# EAGLE design n64cart-v3-soic-16 (EAGLE 9.6.2)
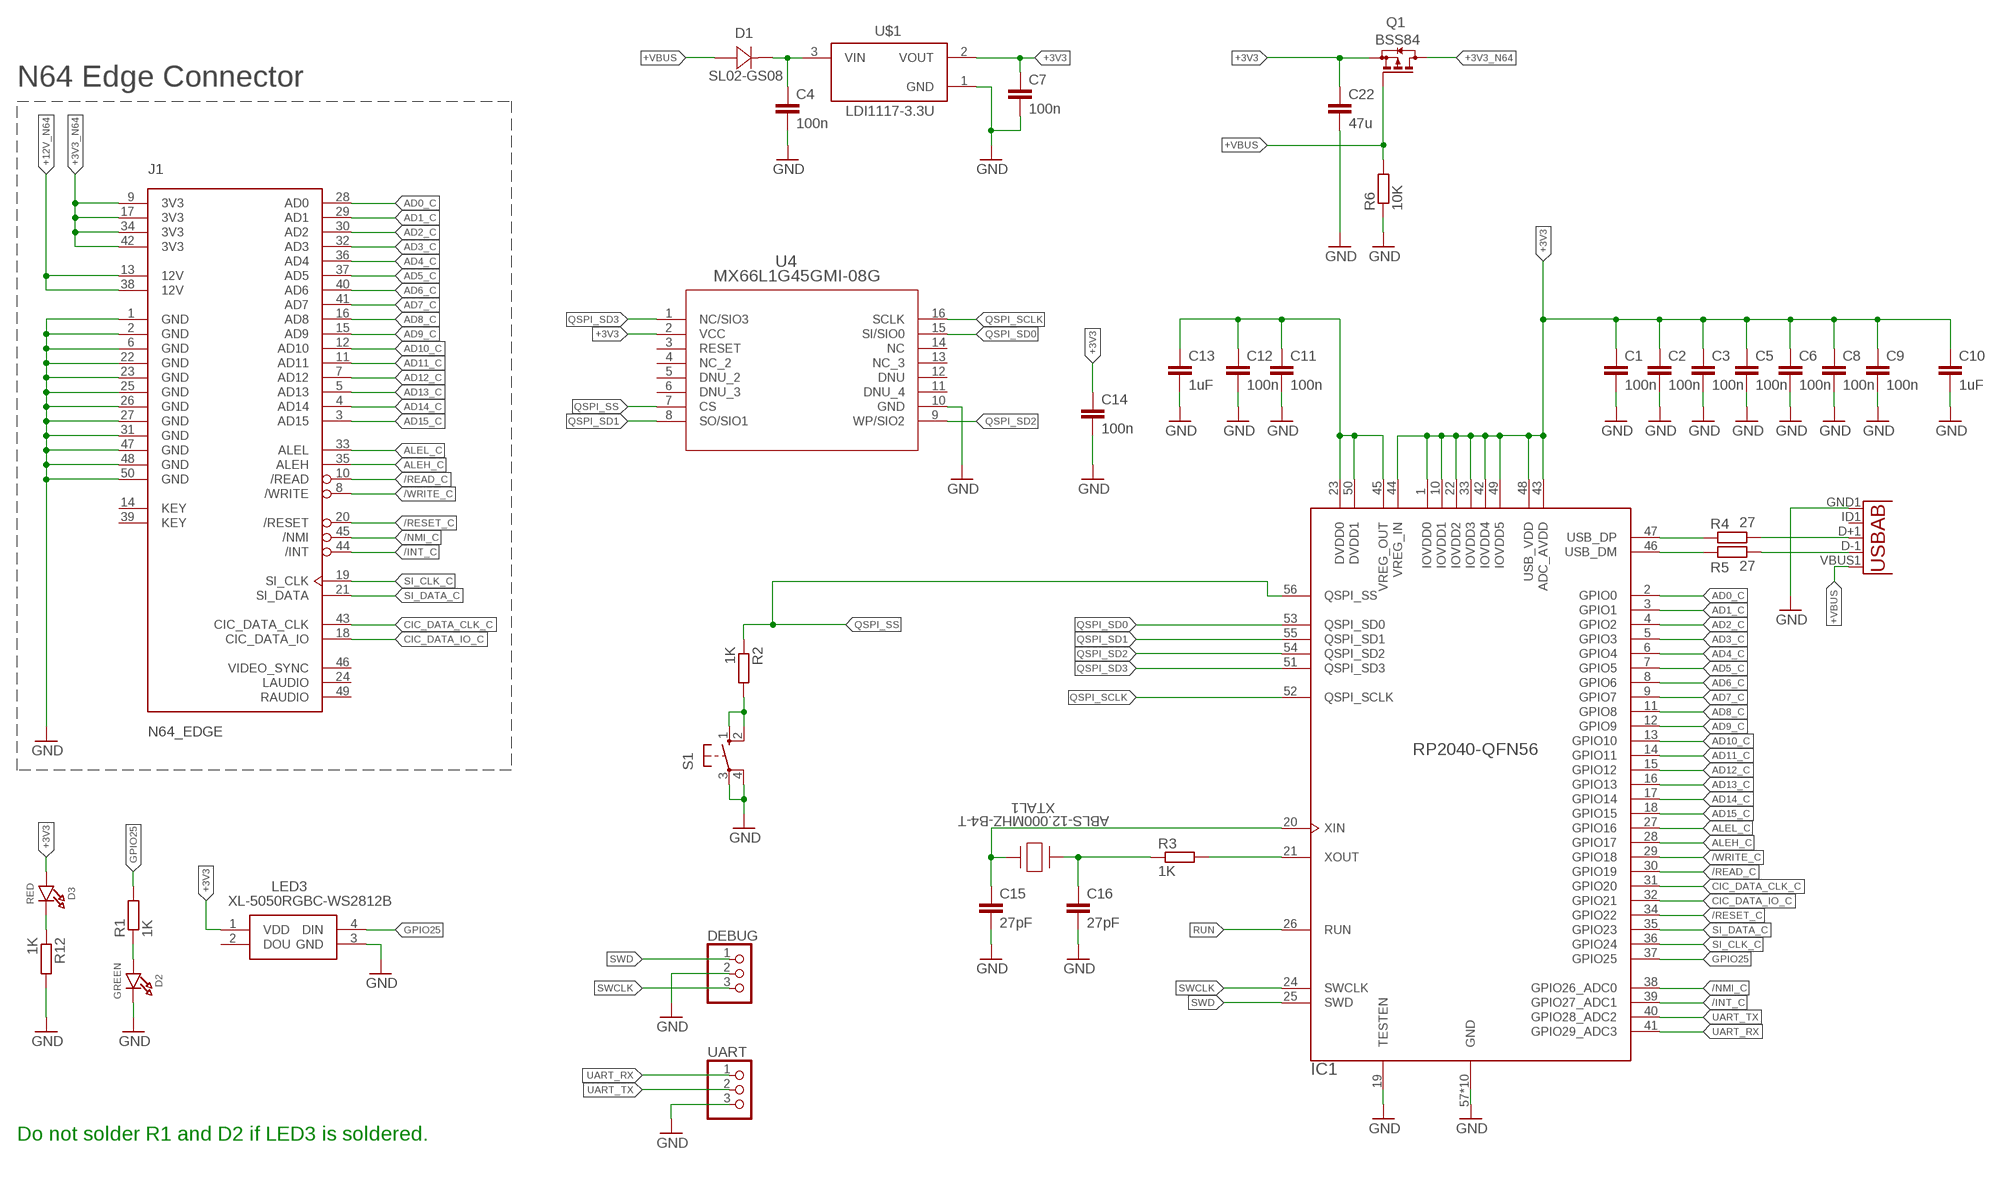
[diagram p0: schematic, sheet 1]

## Parts
C1  100n  C-EUC0402  [C0402]
C2  100n  C-EUC0402  [C0402]
C3  100n  C-EUC0402  [C0402]
C4  100n  C-EUC0603  [C0603]
C5  100n  C-EUC0402  [C0402]
C6  100n  C-EUC0402  [C0402]
C7  100n  C-EUC0603  [C0603]
C8  100n  C-EUC0402  [C0402]
C9  100n  C-EUC0402  [C0402]
C10  1uF  C-EUC0402  [C0402]
C11  100n  C-EUC0402  [C0402]
C12  100n  C-EUC0402  [C0402]
C13  1uF  C-EUC0402  [C0402]
C14  100n  C-EUC0402  [C0402]
C15  27pF  C-EUC0402  [C0402]
C16  27pF  C-EUC0402  [C0402]
C22  47u  C-EUC0805  [C0805]
D1  SL02-GS08  SL02-GS08DIODE_SL02-GS08_VIS-M  [DIODE_SL02-GS08_VIS-M]
D2  GREEN  LED0603_NOOUTLINE  [CHIPLED_0603_NOOUTLINE]
D3  RED  LED0603_NOOUTLINE  [CHIPLED_0603_NOOUTLINE]
DEBUG  PINHD-1X3  [1X03]
IC1  RP2040-QFN56  [RP2040-QFN-56]
J1  N64_EDGE  [N64_EDGE]
LED3  XL-5050RGBC-WS2812B  [XL5050RGBCWS2812B]
Q1  BSS84  [SOT23]
R1  1K  R-EU_R0603  [R0603]
R2  1K  R-EU_R0402  [R0402]
R3  1K  R-EU_R0402  [R0402]
R4  27  R-EU_R0402  [R0402]
R5  27  R-EU_R0402  [R0402]
R6  10K  R-EU_R0603  [R0603]
R12  1K  R-EU_R0603  [R0603]
S1  10-XX  [B3F-10XX]
U2  USB""  [USB-MICRO-SMD]
U4  MX66L1G45GMI-08G  MX66L1G45GMI-08GSOP_16L_300_MAC-L  [SOP_16L_300_MAC-L]
U$1  LDI1117-3.3U  [LDI1117-3.3U]
UART  PINHD-1X3  [1X03]
XTAL1  ABLS-12.000MHZ-B4-T  [XTAL_ABLS_ABR]

## Nets
+3V3: C1.1 C2.1 C3.1 C5.1 C6.1 C7.1 C8.1 C9.1 C10.1 C14.1 C22.1 D3.A IC1.1(IOVDD0) IC1.10(IOVDD1) IC1.22(IOVDD2) IC1.33(IOVDD3) IC1.42(IOVDD4) IC1.43(ADC_AVDD) IC1.44(VREG_IN) IC1.48(USB_VDD) IC1.49(IOVDD5) LED3.1(VDD) Q1.2(S) U4.2(VCC) U$1.2(VOUT)
+3V3_N64: J1.9(3V3) J1.17(3V3) J1.34(3V3) J1.42(3V3) Q1.3(D)
+12V_N64: J1.13(12V) J1.38(12V)
+VBUS: D1.2 Q1.1(G) R6.2 U2.VBUS1(VBUS)
/INT_C: IC1.39(GPIO27_ADC1) J1.44(/INT)
/NMI_C: IC1.38(GPIO26_ADC0) J1.45(/NMI)
/READ_C: IC1.30(GPIO19) J1.10(/READ)
/RESET_C: IC1.34(GPIO22) J1.20(/RESET)
/WRITE_C: IC1.29(GPIO18) J1.8(/WRITE)
AD0_C: IC1.2(GPIO0) J1.28(AD0)
AD1_C: IC1.3(GPIO1) J1.29(AD1)
AD2_C: IC1.4(GPIO2) J1.30(AD2)
AD3_C: IC1.5(GPIO3) J1.32(AD3)
AD4_C: IC1.6(GPIO4) J1.36(AD4)
AD5_C: IC1.7(GPIO5) J1.37(AD5)
AD6_C: IC1.8(GPIO6) J1.40(AD6)
AD7_C: IC1.9(GPIO7) J1.41(AD7)
AD8_C: IC1.11(GPIO8) J1.16(AD8)
AD9_C: IC1.12(GPIO9) J1.15(AD9)
AD10_C: IC1.13(GPIO10) J1.12(AD10)
AD11_C: IC1.14(GPIO11) J1.11(AD11)
AD12_C: IC1.15(GPIO12) J1.7(AD12)
AD13_C: IC1.16(GPIO13) J1.5(AD13)
AD14_C: IC1.17(GPIO14) J1.4(AD14)
AD15_C: IC1.18(GPIO15) J1.3(AD15)
ALEH_C: IC1.28(GPIO17) J1.35(ALEH)
ALEL_C: IC1.27(GPIO16) J1.33(ALEL)
CIC_DATA_CLK_C: IC1.31(GPIO20) J1.43(CIC_DATA_CLK)
CIC_DATA_IO_C: IC1.32(GPIO21) J1.18(CIC_DATA_IO)
GND: C1.2 C2.2 C3.2 C4.2 C5.2 C6.2 C7.2 C8.2 C9.2 C10.2 C11.2 C12.2 C13.2 C14.2 C15.2 C16.2 C22.2 D2.C DEBUG.2 IC1.19(TESTEN) IC1.57(GND) IC1.58(GND) IC1.59(GND) IC1.60(GND) IC1.61(GND) IC1.62(GND) IC1.63(GND) IC1.64(GND) IC1.65(GND) IC1.66(GND) J1.1(GND) J1.2(GND) J1.6(GND) J1.22(GND) J1.23(GND) J1.25(GND) J1.26(GND) J1.27(GND) J1.31(GND) J1.47(GND) J1.48(GND) J1.50(GND) LED3.3(GND) R6.1 R12.2 S1.3(P) S1.4(P1) U2.GND1(GND) U4.10(GND) U$1.1(GND) UART.3
GPIO25: IC1.37(GPIO25) LED3.4(DIN) R1.2
N$1: C4.1 D1.1 U$1.3(VIN)
N$2: R5.2 U2.D-1(D-)
N$3: R4.2 U2.D+1(D+)
N$4: D3.C R12.1
N$5: C11.1 C12.1 C13.1 IC1.23(DVDD0) IC1.45(VREG_OUT) IC1.50(DVDD1)
N$8: D2.A R1.1
N$16: R2.2 S1.1(S) S1.2(S1)
N$17: C16.1 R3.1 XTAL1.1
N$18: C15.1 IC1.20(XIN) XTAL1.2
N$19: IC1.21(XOUT) R3.2
N$20: IC1.47(USB_DP) R4.1
N$21: IC1.46(USB_DM) R5.1
QSPI_SCLK: IC1.52(QSPI_SCLK) U4.16(SCLK)
QSPI_SD0: IC1.53(QSPI_SD0) U4.15(SI/SIO0)
QSPI_SD1: IC1.55(QSPI_SD1) U4.8(SO/SIO1)
QSPI_SD2: IC1.54(QSPI_SD2) U4.9(WP/SIO2)
QSPI_SD3: IC1.51(QSPI_SD3) U4.1(NC/SIO3)
QSPI_SS: IC1.56(QSPI_SS) R2.1 U4.7(CS)
RUN: IC1.26(RUN)
SI_CLK_C: IC1.36(GPIO24) J1.19(SI_CLK)
SI_DATA_C: IC1.35(GPIO23) J1.21(SI_DATA)
SWCLK: DEBUG.3 IC1.24(SWCLK)
SWD: DEBUG.1 IC1.25(SWD)
UART_RX: IC1.41(GPIO29_ADC3) UART.1
UART_TX: IC1.40(GPIO28_ADC2) UART.2
Unconnected: J1.14(KEY) J1.24(LAUDIO) J1.39(KEY) J1.46(VIDEO_SYNC) J1.49(RAUDIO) LED3.2(DOU) U2.ID1(USBID) U4.3(RESET) U4.4(NC_2) U4.5(DNU_2) U4.6(DNU_3) U4.11(DNU_4) U4.12(DNU) U4.13(NC_3) U4.14(NC)

## Notes on the sheet
- N64 Edge Connector
- Do not solder R1 and D2 if LED3 is soldered.

## Library data of the parts
C1-C16 C22 = rcl:C-EU: CAPACITOR, European symbol; SPICEPREFIX: C
D1 = SL02-GS08:SL02-GS08; COPYRIGHT: Copyright (C) 2022 Ultra Librarian. All rights reserved.; DIGI-KEY_PART_NUMBER_1: SL02-GS08TR-ND; DIGI-KEY_PART_NUMBER_2: SL02-GS08CT-ND; DIGI-KEY_PART_NUMBER_3: SL02-GS08DKR-ND; MANUFACTURER_PART_NUMBER: SL02-GS08; MFR_NAME: Vishay
D2 D3 = microbuilder:LED: LED 0603 - 0603 Surface Mount Package 2mA: Green LED - Low Power (3.9mcd, 2ma, 1.7Vf) - Digikey: 475-2709-2-ND Orange LED - Low Power (9.8mcd, 2ma, 1.8Vf) - Digikey: 475-1194-2-ND Red LED - Low Power (5mcd, 2ma, 1.8Vf) - Digikey: 475-1195-2-ND Yellow LED - Low Power (7mcd, 2ma, 1.8Vf) - Digikey: 475-1196-2-ND 5mA: Blue LED - Low Power (17mcd, 5ma, 2.9Vf) - Digikey: LNJ937W8CRACT-ND 0805 - 0805 Surface Mount Package 2mA: Red LED (8.8mcd, 2mA, 1.8Vf, Clear) - Low Power [Digikey: 475-2510-1-ND] Green LED (5mcd, 2mA, 1.8Vf, Clear) - Low Power [Digikey: 475-2730-1-ND] Yellow LED (11.3mcd, 2mA, 1.8Vf, Clear) - Low Power [Digikey: 475-2555-1-ND] 20mA: Red LED (104mcd, 20mA, Diffused) - LS R976 [Digikey: 475-1278-6-ND] Red LED (12mcd, 20mA, 2.0Vf, Clear) - APT2012EC [Digikey: 754-1128-1-ND] Green LED (15mcd, 20mA, 2.2Vf, Clear) - APT2012GC [Digikey: 754-1131-1-ND] Orange LED (160mcd, 20mA, 2.1Vf, Clear) - APT2012SECK [Digikey: 754-1130-1-ND] 1206 - 1206 Surface Mount Package Green LED (26mcd, 20mA, Diffused) - LG N971 [Digikey: 475-1407-6-ND] Red LED (15mcd, 20mA, Diffused) - LH N974 [Digikey: 475-1416-6-ND] Cree - Cree High-Power Surface Mount LEDs XPEBWT-L1-0000-00D50 - White 111lm 350mA 2.9Vf 6200K 110° XTEAWT-00-0000-00000LEE3 - White 114lm 350mA 2.85Vf 5000K 115° Everlight - Everlight 45-21 Series Surface Mount LEDs 45-21/QK2C-B2832AC2CB2/2T - Warm White 2000mcd 20mA 3.25Vf 3050K 120° 45-21/LK2C-B38452C4CB2/2T - Nuetral White 2000mcd 20mA 3.25Vf 4150K 120° 45-21/LK2C-B50634C6CB2/2T - Cold White 2200mcd 20mA 3.25Vf 5650K 120° PLCC2 Reverse Mount LS T77K-J1L2-1-0-2-R18-Z - Red 11.25mcd 2mA 1.8Vf 630nm 120° LO T77K-L1M2-24-Z - Orange 19.6mcd 2mA 1.8Vf 606nm 120° LY T77K-K2M1-26-Z - Yellow 15.7mcd 2mA 1.8Vf 587nm 120°
DEBUG UART = pinhead:PINHD-1X3: PIN HEADER
IC1 = RpiPico:RP2040-QFN56
J1 = SummerCart64:N64_EDGE: Nintendo 64 cartridge edge connector.
LED3 = XL-5050RGBC-WS2812B:XL-5050RGBC-WS2812B: SMD,5x5x1.6mm Light Emitting Diodes (LED) RoHS Source: Datasheet <https://datasheet.lcsc.com/lcsc/2211021800_XINGLIGHT-XL-5050RGBC-WS2812B_C2843785.pdf>; DESCRIPTION: SMD,5x5x1.6mm Light Emitting Diodes (LED) RoHS; HEIGHT: 1.85mm; MANUFACTURER_NAME: XINGLIGHT; MANUFACTURER_PART_NUMBER: XL-5050RGBC-WS2812B
Q1 = transistor-small-signal:BSS84: P-CHANNEL MOS FET
R1-R6 R12 = rcl:R-EU_: RESISTOR, European symbol; SPICEPREFIX: R
S1 = switch-omron:10-XX: OMRON SWITCH; MPN: B3F-1000; OC_FARNELL: 176432; OC_NEWARK: 36M3542
U2 = MicroUSB:USB: This is a USB AB connector that is compatible with USB OTG. i.e. this connector can serve as a host or device
U4 = MX66L1G45GMI-08G:MX66L1G45GMI-08G; COPYRIGHT: Copyright (C) 2024 Ultra Librarian. All rights reserved.; MANUFACTURER_PART_NUMBER: MX66L1G45GMI-08G; MFR_NAME: Macronix
U$1 = LDI1117-3.3U:LDI1117-3.3U
XTAL1 = abls-12.000MHZ-B4-T:ABLS-12.000MHZ-B4-T; COPYRIGHT: Copyright (C) 2022 Ultra Librarian. All rights reserved.; MANUFACTURER_PART_NUMBER: ABLS-12.000MHZ-B4-T; MFR_NAME: Abracon

## Net classes
1 power: width 0.152 mm

## Board
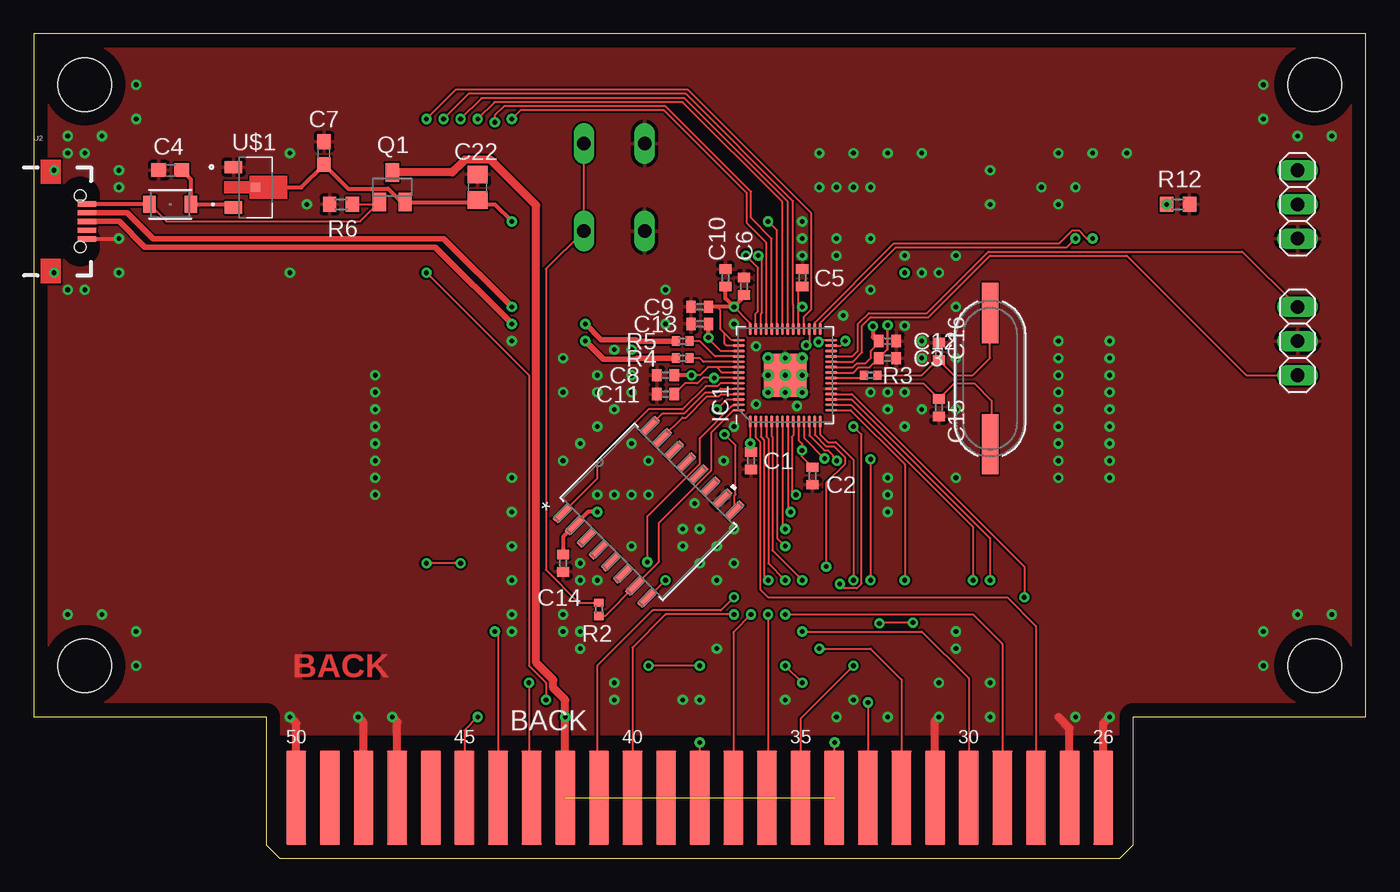
[diagram p1: board, top side]
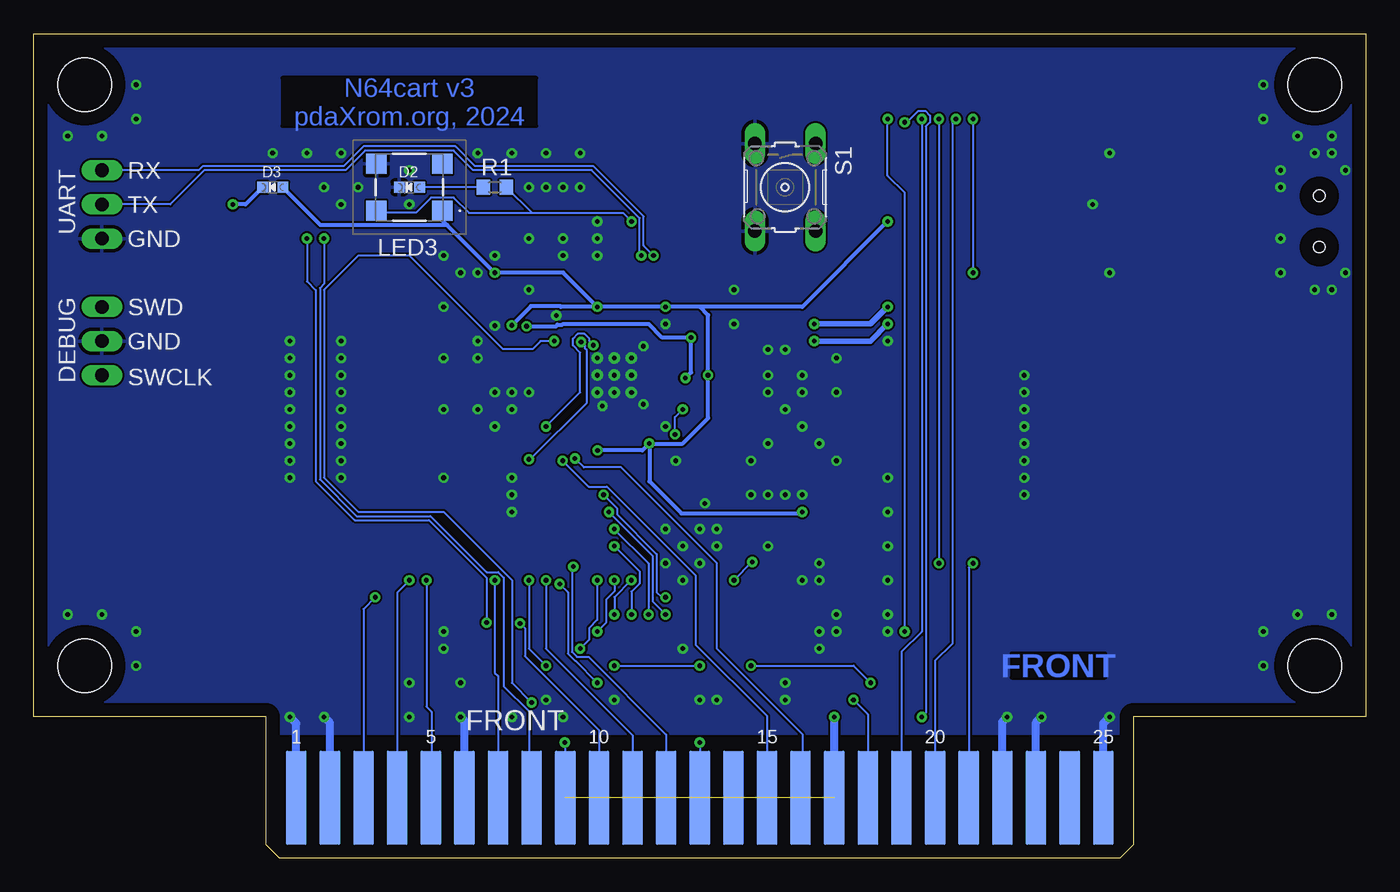
[diagram p2: board, bottom side, seen from below]

Size 99.06 x 61.29 mm. Coordinates in mm from the lower left corner, seen from the top.
Outline: 17.27,10.5 0,10.5 0,61.29 99.06,61.29 99.06,10.5 81.79,10.5
Copper layers (1*16): Top 0.035mm / dielectric 1.5mm / Bottom 0.035mm
Design rules "default *": minimum track width 6mil, minimum drill 0.35mm, track to track 6mil, track to pad 6mil, pad to pad 6mil, via to via 6mil, smd to smd 6mil, copper to edge 40mil, drill to drill 6mil, minimum pad ring 10mil, minimum via ring 8mil, stop-mask expansion 4mil, vias tented up to drill 0.4mm, thermal gap 10mil
Holes 4 mm at 3.81,14.31 95.25,14.31 95.25,57.49 3.81,57.49

### Footprints (pad centres in the part's own frame; a part is rotated, then mirrored left to right if it is on the bottom)
C0402 = smd 0.7 x 0.9: 1 -0.65,0; 2 0.65,0
C0603 = smd 1.1 x 1: 1 -0.85,0; 2 0.85,0
C0805 = smd 1.3 x 1.5: 1 -0.95,0; 2 0.95,0
DIODE_SL02-GS08_VIS-M = smd 0.94 x 1.245: 1 -1.537,0; 2 1.537,0
CHIPLED_0603_NOOUTLINE = smd 0.8 x 0.8: A 0,-0.75; C 0,0.75
1X03 = drill 1.016 long: 1 -2.54,0; 2 0,0; 3 2.54,0
RP2040-QFN-56 = smd 0.875 x 0.2: 1 -3.438,2.6; 2 -3.438,2.2; 3 -3.438,1.8; 4 -3.438,1.4; 5 -3.438,1; 6 -3.438,0.6; 7 -3.438,0.2; 8 -3.438,-0.2; 9 -3.438,-0.6; 10 -3.438,-1; 11 -3.438,-1.4; 12 -3.438,-1.8; 13 -3.438,-2.2; 14 -3.438,-2.6; 29 3.438,-2.6; 30 3.438,-2.2; 31 3.438,-1.8; 32 3.438,-1.4; 33 3.438,-1; 34 3.438,-0.6; 35 3.438,-0.2; 36 3.438,0.2; 37 3.438,0.6; 38 3.438,1; 39 3.438,1.4; 40 3.438,1.8; 41 3.438,2.2; 42 3.438,2.6 | smd 0.2 x 0.875: 15 -2.6,-3.438; 16 -2.2,-3.438; 17 -1.8,-3.438; 18 -1.4,-3.438; 19 -1,-3.438; 20 -0.6,-3.438; 21 -0.2,-3.438; 22 0.2,-3.438; 23 0.6,-3.438; 24 1,-3.438; 25 1.4,-3.438; 26 1.8,-3.438; 27 2.2,-3.438; 28 2.6,-3.438; 43 2.6,3.438; 44 2.2,3.438; 45 1.8,3.438; 46 1.4,3.438; 47 1,3.438; 48 0.6,3.438; 49 0.2,3.438; 50 -0.2,3.438; 51 -0.6,3.438; 52 -1,3.438; 53 -1.4,3.438; 54 -1.8,3.438; 55 -2.2,3.438; 56 -2.6,3.438 | smd 3.2 x 3.2: 57 0,0 | drill 0.35 pad 0.6: 58 -1.275,1.275; 59 0,1.275; 60 1.275,1.275; 61 -1.275,0; 62 0,0; 63 1.275,0; 64 -1.275,-1.275; 65 0,-1.275; 66 1.275,-1.275
N64_EDGE = smd 1.5 x 7 bottom: 1 30,-6; 2 27.5,-6; 3 25,-6; 4 22.5,-6; 5 20,-6; 6 17.5,-6; 7 15,-6; 8 12.5,-6; 9 10,-6; 10 7.5,-6; 11 5,-6; 12 2.5,-6; 13 0,-6; 14 -2.5,-6; 15 -5,-6; 16 -7.5,-6; 17 -10,-6; 18 -12.5,-6; 19 -15,-6; 20 -17.5,-6; 21 -20,-6; 22 -22.5,-6; 23 -25,-6; 24 -27.5,-6; 25 -30,-6 | smd 1.5 x 7: 26 30,-6; 27 27.5,-6; 28 25,-6; 29 22.5,-6; 30 20,-6; 31 17.5,-6; 32 15,-6; 33 12.5,-6; 34 10,-6; 35 7.5,-6; 36 5,-6; 37 2.5,-6; 38 0,-6; 39 -2.5,-6; 40 -5,-6; 41 -7.5,-6; 42 -10,-6; 43 -12.5,-6; 44 -15,-6; 45 -17.5,-6; 46 -20,-6; 47 -22.5,-6; 48 -25,-6; 49 -27.5,-6; 50 -30,-6
XL5050RGBCWS2812B = smd 1.5 x 1.5: 1 -2.45,1.75; 2 -2.45,-1.75; 3 2.45,-1.75; 4 2.45,1.75
SOT23 = smd 1 x 1.4: 1 -0.95,-1.1; 2 0.95,-1.1; 3 0,1.1
R0603 = smd 1 x 1.1: 1 -0.85,0; 2 0.85,0
R0402 = smd 0.6 x 0.7: 1 -0.5,0; 2 0.5,0
B3F-10XX = drill 1.016 long: 1 -3.251,2.261; 2 3.251,2.261; 3 -3.251,-2.261; 4 3.251,-2.261
USB-MICRO-SMD = smd 1.4 x 0.4: D+1 2.7,0; D-1 2.7,0.65; GND1 2.7,-1.3; ID1 2.7,-0.65; VBUS1 2.7,1.3 | hole 0.85: 2.2,1.9; 2.2,-1.9
SOP_16L_300_MAC-L = smd 1.6 x 0.508: 1 -4.597,4.445; 2 -4.597,3.175; 3 -4.597,1.905; 4 -4.597,0.635; 5 -4.597,-0.635; 6 -4.597,-1.905; 7 -4.597,-3.175; 8 -4.597,-4.445; 9 4.597,-4.445; 10 4.597,-3.175; 11 4.597,-1.905; 12 4.597,-0.635; 13 4.597,0.635; 14 4.597,1.905; 15 4.597,3.175; 16 4.597,4.445
LDI1117-3.3U = smd 1.3 x 0.9: 1 -1.65,1.5; 3 -1.65,-1.5 | smd 0.7 x 0.7: 2 0,0
XTAL_ABLS_ABR = smd 4.47 x 1.219: 1 -4.877,0; 2 4.877,0

### Placement (x,y rotation side)
C1  53.34,29.55 270 top
C2  57.91,28.41 270 top
C3  63.5,37.17 0 top
C4  10.16,51.14 180 top
C5  57.15,43.14 90 top
C6  52.83,42.5 90 top
C7  21.59,52.41 90 top
C8  46.99,35.9 180 top
C9  49.53,40.98 180 top
C10  51.44,43.14 90 top
C11  46.99,34.5 180 top
C12  63.5,38.44 0 top
C13  49.53,39.71 180 top
C14  39.37,21.93 270 top
C15  67.31,33.49 270 top
C16  67.31,37.68 90 top
C22  33.02,49.87 90 top
D1  10.16,48.6 180 top
D2  71.12,49.87 90 bottom
D3  81.28,49.87 90 bottom
DEBUG  93.98,38.44 270 top
IC1  55.88,35.9 90 top
J1  49.53,10.5 0 top
LED3  71.12,49.87 180 bottom
Q1  26.67,49.87 0 top
R1  64.77,49.87 0 bottom
R2  42.04,18.5 90 top
R3  62.23,35.9 180 top
R4  48.26,37.17 180 top
R5  48.26,38.44 180 top
R6  22.86,48.6 0 top
R12  85.09,48.6 0 top
S1  43.18,49.87 270 bottom
U2  1.27,47.33 0 top
U4  45.72,25.74 45 top
U$1  16.51,49.87 0 top
UART  93.98,48.6 270 top
XTAL1  71.12,35.65 270 top

### Tracks (layer width: path | path; a pad name or v marks a point on that pad's centre or on a via)
+3V3  (via drill 0.35)
  Top 0.152: 50.43,40.98 C9.1 50.8,40.98 51.05,40.73 51.05,39.33 51.37,39.01 | IC1.33 56.88,41.25 | C5.1 56.88,42.22 56.88,41.25 | IC1.22 60.96,36.1 61.34,36.48 62.16,36.48 C3.1 | IC1.1 v53.28,30.82 | IC1.48 50.8,36.5 | 50.8,36.5 50.13,36.5 49.53,35.9 v48.91,35.9 | IC1.49 51.2,36.1 50.8,36.5 | v57.15,40.98 56.88,41.25 | v64.77,43.52 64.52,43.52 | IC1.10 56.88,31.07 57.13,30.82 v57.13,30.31 57.13,29.84 C2.1 | IC1.43 51.88,38.5 51.37,39.01 | IC1.44 51.52,38.1 51.37,38.25 51.37,39.01 | v52.07,40.98 53.28,39.77 IC1.42
  Top 0.203: v63.5,39.61 63.5,37.82 C3.1
  Top 0.305: 32.72,48.62 32.86,48.76 | 32.86,48.76 C22.1 33.34,48.6 34.29,48.6 v35.56,47.33 | v48.91,35.9 C8.1 | v52.07,40.98 C9.1 | v52.07,40.98 51.44,41.62 C10.1 | v52.07,40.98 52.83,41.74 C6.1 | v53.28,30.82 53.28,30.26 C1.1 | v41.91,25.74 41.23,25.74 U4.2 39.37,23.88 C14.1 | 16.72,50.08 U$1.2 19.9,49.87 C7.1 23.38,49.77 26.35,49.77 26.46,49.66 27.35,48.77 Q1.2 32.85,48.77 32.86,48.76
  Top 0.61: 32.87,48.77 C22.1 | U$1.2 16.93,50.29
  Bottom 0.305: v35.56,47.33 41.91,40.98 49.53,40.98 | 49.53,40.98 v52.07,40.98 v57.15,40.98 | v57.15,40.98 59.87,40.98 59.91,41.03 62.08,41.03 v63.5,39.61 | v57.15,40.98 59.69,43.52 v64.77,43.52 68.31,47.06 | 49.53,40.98 48.91,40.36 v48.91,35.9 48.91,32.71 50.8,30.82 v53.28,30.82 | v53.28,30.82 53.79,30.31 v57.13,30.31 | v53.28,30.82 53.28,28.02 50.9,25.64 42.01,25.64 v41.91,25.74 | 68.31,47.06 77.72,47.06 D3.A | LED3.1 68.67,47.42 68.31,47.06
+3V3_N64  (via drill 0.35)  (1 unrouted)
  Top 0.152: 59.53,4.63 J1.34 59.53,8.56 v59.56,8.6
  Top 0.61: J1.42 v39.53,10.5 39.53,11.77 38.63,12.67 38.63,13.26 37.36,14.53 37.36,48.52 33.96,51.93 32.08,51.93 31.52,51.37 31.27,51.12 31.12,50.97 Q1.3
  Bottom 0.152: J1.34 59.53,4.63 59.56,4.66 v59.56,8.6
  Bottom 0.61: J1.42 v39.53,10.5
+12V_N64  (via drill 0.35)
  Top 0.152: J1.38 v49.53,8.6
  Bottom 0.152: v49.53,8.6 J1.38
+VBUS
  Top 0.152: D1.2 9.89,47.33 24.28,47.33 25.48,48.52 | 25.48,48.52 Q1.1 | R6.2 25.4,48.6 25.48,48.52
  Top 0.305: U2.VBUS1 8.59,48.63 D1.2
/INT_C  (via drill 0.35)
  Top 0.152: IC1.39 54.48,45.76 53.03,47.2 53.03,49.41 46.86,55.59 36.2,55.59 v35.56,54.95 | v34.29,16.85 34.53,16.61 J1.44
  Bottom 0.152: v35.56,54.95 35.56,50.73 34.29,49.46 v34.29,16.85
/NMI_C  (via drill 0.35)
  Top 0.152: IC1.38 54.88,46.06 53.34,47.6 53.34,49.54 46.99,55.89 34.97,55.89 34.29,55.21 v34.29,54.7 | v33.02,10.5 32.03,9.51 J1.45
  Bottom 0.152: v34.29,54.7 34.13,54.7 33.27,55.56 32.77,55.56 32.41,55.2 32.41,54.7 32.72,54.4 32.72,10.8 v33.02,10.5
/READ_C  (via drill 0.35)
  Top 0.152: IC1.30 58.08,39.8 63.98,45.7 76.26,45.7 77.22,46.67 77.72,46.67 78.33,46.06 v78.74,46.06 | v65.38,17.51 62.95,17.51 v62.89,17.46
  Bottom 0.152: v78.74,46.06 78.74,42.88 78.08,42.23 78.08,28.03 75.18,25.13 69.67,25.13 65.38,20.84 v65.38,17.51 | v62.89,17.46 62.53,17.1 62.53,15.03 57.03,9.52 J1.10
/RESET_C  (via drill 0.35)
  Top 0.152: IC1.34 56.48,41.15 56.47,41.16 56.47,48.85 48.52,56.8 32.33,56.8 v30.48,54.95
  Bottom 0.152: v30.48,54.95 30.76,54.67 30.76,15.93 32.03,14.66 J1.20
/WRITE_C  (via drill 0.35)
  Top 0.152: IC1.29 58.48,39.77 64.11,45.4 76.81,45.4 v77.47,46.06
  Bottom 0.152: v77.47,46.06 77.47,42.68 77.78,42.38 77.78,28.15 75.06,25.43 69.55,25.43 65.38,21.27 64.52,21.27 64.11,20.86 64.11,12.79 62.23,10.91 62.23,4.15 62.03,4.35 J1.8
AD0_C
  Top 0.152: IC1.2 53.68,31.28 54.02,30.94 54.02,19.98 54.61,19.39 72.39,19.39 74.53,17.25 J1.28
AD1_C  (via drill 0.35)
  Top 0.152: IC1.3 54.08,31.31 54.32,31.07 54.32,20.95 54.61,20.66 v54.62,20.66 | v55.88,18.12 69.85,18.12 72.03,15.94 J1.29
  Bottom 0.152: v54.62,20.66 55.88,19.41 v55.88,18.12
AD2_C  (via drill 0.35)
  Top 0.152: v55.88,20.66 54.63,21.91 54.63,31.19 54.48,31.34 IC1.4 | v57.15,16.85 66.04,16.85 69.53,13.36 J1.30
  Bottom 0.152: v55.88,20.66 55.88,19.84 56.49,19.23 56.49,17.51 v57.15,16.85
AD3_C  (via drill 0.35)
  Top 0.152: IC1.5 54.88,31.37 54.93,31.32 54.93,22.88 v57.15,20.66 | v58.42,15.58 62.23,15.58 64.53,13.28 J1.32
  Bottom 0.152: v58.42,15.58 57.76,16.24 57.76,17.1 57.15,17.71 v57.15,20.66
AD4_C  (via drill 0.35)
  Top 0.152: IC1.6 55.28,23.8 v55.88,23.2 | v54.61,18.12 54.61,4.58 J1.36
  Bottom 0.152: v54.61,18.12 54.61,19.82 54.02,20.41 54.02,21.34 v55.88,23.2
AD5_C  (via drill 0.35)
  Top 0.152: IC1.7 55.68,24.68 v55.89,24.47 | J1.37 52.03,16.81 v53.34,18.12
  Bottom 0.152: v55.89,24.47 53.34,21.92 v53.34,18.12
AD6_C  (via drill 0.35)
  Top 0.152: IC1.8 56.08,25.95 v56.29,25.74 | v52.07,18.12 46.99,18.12 44.53,15.66 J1.40
  Bottom 0.152: v52.07,18.12 53.03,19.09 53.03,22.48 56.29,25.73 v56.29,25.74
AD7_C  (via drill 0.35)
  Top 0.152: IC1.9 56.48,31.42 56.38,31.33 56.38,27.31 v56.69,27.01 | v52.07,19.39 51.1,18.43 46.02,18.43 41.91,14.31 41.91,4.62 J1.41
  Bottom 0.152: v56.69,27.01 55.68,26 55.68,25.55 52.73,22.6 52.73,19.77 52.35,19.39 v52.07,19.39
AD8_C  (via drill 0.35)
  Top 0.152: IC1.11 57.28,31.24 v58.81,29.71
  Bottom 0.152: J1.16 41.91,4.62 41.91,9.23 48.26,15.58 48.26,21.93 55.37,29.04 58.15,29.04 v58.81,29.71
AD9_C  (via drill 0.35)
  Top 0.152: IC1.12 57.68,31.43 58.8,30.31 59.07,30.31 59.42,29.96 59.42,29.85 v59.72,29.55
  Bottom 0.152: v59.72,29.55 57.79,27.62 56.44,27.62 49.84,21.02 49.84,15.89 44.53,10.58 J1.15
AD10_C  (via drill 0.35)
  Top 0.152: IC1.13 58.08,31.46 58.93,30.62 59.51,30.62 60.33,29.8 60.33,29.3 58.93,27.9 v58.93,21.68
  Bottom 0.152: v58.93,21.68 59.03,21.58 59.03,15.33 58.67,14.97 57.81,14.97 52.03,9.19 J1.12
AD11_C  (via drill 0.35)
  Top 0.152: IC1.14 58.48,31.49 59.05,30.92 59.64,30.92 60.96,29.6 v60.96,20.66
  Bottom 0.152: v60.96,20.66 60.96,15.58 54.53,9.15 J1.11
AD12_C  (via drill 0.35)
  Top 0.152: IC1.15 60.74,33.3 64.77,29.27 v64.77,20.66
  Bottom 0.152: v64.77,20.66 64.77,13.8 64.52,13.55 64.52,4.51 J1.7
AD13_C  (via drill 0.35)
  Top 0.152: IC1.16 60.77,33.7 69.85,24.62 v69.85,20.66
  Bottom 0.152: v69.85,20.66 69.85,11.26 69.47,10.88 69.47,4.56 J1.5
AD14_C  (via drill 0.35)
  Top 0.152: IC1.17 60.8,34.1 71.12,23.79 v71.12,20.66
  Bottom 0.152: v71.12,20.66 72.03,19.75 J1.4
AD15_C  (via drill 0.35)
  Top 0.152: IC1.18 60.84,34.5 73.66,21.68 v73.66,19.39
  Bottom 0.152: v73.66,19.39 74.53,18.52 J1.3
ALEH_C  (via drill 0.35)
  Top 0.152: v62.23,29.65 v62.23,20.66 | v60.96,14.31 57.03,10.38 J1.35 | IC1.28 58.48,38.5 v58.35,38.37
  Bottom 0.152: v62.23,29.65 62.13,29.65 57.91,33.87 57.91,37.75 58.05,37.88 58.05,38.07 v58.35,38.37 | v62.23,20.66 62.23,15.58 v60.96,14.31
ALEL_C  (via drill 0.35)
  Top 0.152: v62.03,11.57 J1.33 | IC1.27 60.01,38.1 v60.35,38.44
  Bottom 0.152: v60.35,38.44 61.37,38.44 61.98,37.83 64.16,37.83 71.12,44.79 74.93,44.79 77.47,42.25 77.47,28.28 74.93,25.74 68.56,25.74 63.5,20.68 63.5,13.04 v62.03,11.57
CIC_DATA_CLK_C  (via drill 0.35)
  Top 0.152: IC1.31 57.68,38.37 v57.44,38.13 | v59.94,20.38 60.27,20.05 61.21,20.05 61.57,20.41 61.57,31.48 v60.96,32.09 | v57.15,13.04 v55.88,14.31 | v49.53,14.31 v45.72,14.31 | v36.83,13.04 36.83,4.7 J1.43
  Bottom 0.152: v57.44,38.13 57.74,38.44 57.74,38.62 58.1,38.98 58.6,38.98 58.96,38.62 58.96,38.12 58.42,37.58 58.42,34.63 v60.96,32.09 | v59.94,20.38 59.33,19.77 59.33,15.2 58.8,14.67 58.78,14.67 v57.15,13.04 | v55.88,14.31 v49.53,14.31 | v45.72,14.31 38.1,14.31 v36.83,13.04
CIC_DATA_IO_C  (via drill 0.35)
  Top 0.152: IC1.32 57.28,40.25 57.83,40.8 57.83,47.92 48.64,57.11 31.37,57.11 v29.21,54.95 | v29.21,43.52 36.83,35.9 36.83,14.31 38.1,13.04 v38.1,11.77
  Bottom 0.152: v29.21,54.95 v29.21,43.52 | v38.1,11.77 37.03,10.7 J1.18
GND  (via drill 0.35)
  Top 0.305: U2.GND1 6.32,46.03 v6.35,46.06
  Top 0.61: J1.50 19.53,10.02 v19.05,10.5 | J1.48 24.53,10.1 v24.13,10.5 | J1.47 27.03,10.14 v26.67,10.5 | J1.26 79.53,10.02 v80.01,10.5 | J1.27 77.03,9.67 76.2,10.5 | J1.31 67.03,10.22 v67.31,10.5
  Bottom 0.61: J1.50 19.53,10.02 v19.05,10.5 | J1.48 24.53,10.1 v24.13,10.5 | J1.47 27.03,10.14 v26.67,10.5 | J1.31 67.03,10.22 v67.31,10.5 | J1.27 77.03,10.06 v77.47,10.5 | J1.26 79.53,10.02 v80.01,10.5
  other vias: 44.45,35.9 80.01,35.9 80.01,33.36 68.58,28.28 68.58,40.98 57.15,47.33 57.15,46.06 57.15,44.79 43.18,13.04 43.18,11.77 48.26,11.77 49.53,11.77 55.88,11.77 50.8,23.2 59.69,10.5 60.96,11.77 63.5,10.5 67.31,13.04 68.58,16.85 68.58,15.58 71.12,13.04 71.12,10.5 7.62,57.49 7.62,54.95 5.08,53.68 2.54,53.68 2.54,18.12 5.08,18.12 7.62,16.85 7.62,14.31 2.54,52.41 3.81,52.41 6.35,51.14 6.35,49.87 6.35,43.52 3.81,42.25 2.54,42.25 96.52,53.68 93.98,53.68 91.44,54.95 91.44,57.49 91.44,14.31 91.44,16.85 93.98,18.12 96.52,18.12 25.4,30.82 25.4,32.09 25.4,33.36 25.4,34.63 25.4,35.9 25.4,29.55 25.4,28.28 25.4,27.01 80.01,38.44 80.01,37.17 80.01,34.63 80.01,32.09 80.01,30.82 80.01,29.55 80.01,28.28 76.2,28.28 76.2,29.55 76.2,30.82 76.2,32.09 76.2,33.36 76.2,34.63 76.2,35.9 76.2,37.17 76.2,38.44 52.07,32.09 53.72,33.74 56.77,33.61 53.72,38.06 66.04,43.52 67.31,43.52 66.04,38.44 59.69,46.06 46.99,42.25 46.99,39.71 35.56,38.44 39.37,37.17 41.91,35.9 35.56,20.66 35.56,23.2 35.56,25.74 35.56,28.28 63.5,33.36 64.77,32.09 62.23,34.63 63.5,28.28 63.5,27.01 63.5,25.74 1.52,51.14 1.52,43.52 50.8,20.66 50.8,15.58 62.23,42.25 60.2,40.34 44.45,37.8 43.18,37.8 66.04,37.17 68.58,37.17 68.58,33.36 63.5,34.63 64.77,34.63 66.04,33.36 64.77,39.58 52.07,39.71 59.69,44.79 62.23,46.06 64.77,44.79 68.58,44.79 41.91,27.01 44.45,27.01 43.18,27.01 45.72,27.01 44.45,23.2 49.53,21.93 52.07,24.47 52.07,21.93 40.64,15.58 40.64,16.85 39.37,16.85 39.37,18.12 35.56,18.12 35.56,16.85 40.64,20.66 40.64,21.93 41.91,20.66 49.15,26.38 51.31,29.55 39.37,34.63 41.91,34.63 44.45,34.63 43.18,33.36 41.91,32.09 40.64,30.82 39.37,29.55 44.45,30.82 45.72,29.55 48.26,24.47 49.53,24.47 48.26,23.2 58.42,52.41 58.42,49.87 59.69,49.87 60.96,49.87 62.23,49.87 60.96,52.41 63.5,52.41 66.04,52.41 71.12,48.6 71.12,51.14 74.93,49.87 76.2,48.6 77.47,49.87 76.2,52.41 78.74,52.41 81.28,52.41 19.05,52.41 20.32,48.6 19.05,43.52
  pour Top: 0,10.5 17.27,10.5 17.27,9.74 17.78,9.23 81.28,9.23 81.79,9.74 81.79,10.5 99.06,10.5 99.06,61.3 0,61.3
  pour Bottom: 0,61.3 0,10.5 17.27,10.5 17.27,9.74 17.78,9.23 81.28,9.23 81.79,9.74 81.79,10.5 99.06,10.5 99.06,61.3
GPIO25  (via drill 0.35)
  Top 0.152: IC1.37 55.28,46.66 v54.61,47.33
  Bottom 0.152: v54.61,47.33 55.24,47.97 60.96,47.97 62.02,47.97 | 62.02,47.97 66.69,47.97 67.83,49.1 69.52,49.1 70.62,47.99 73.44,47.99 LED3.4 | R1.2 62.02,47.97
N$1
  Top 0.305: U$1.3 14.63,48.6 D1.1 11.7,50.45 C4.1
N$2  (via drill 0.35)
  Top 0.406: R5.2 44.85,38.44 44.75,38.54 42.19,38.54 v41.02,39.71 | U2.D-1 6.97,47.98 8.89,46.06 30.48,46.06 v35.56,40.98
  Bottom 0.406: v41.02,39.71 36.83,39.71 v35.56,40.98
N$3  (via drill 0.35)
  Top 0.406: R4.2 44.85,37.17 44.75,37.07 42.39,37.07 v41.02,38.44 | U2.D+1 6.35,47.33 8.26,45.42 29.84,45.42 v35.56,39.71
  Bottom 0.406: v41.02,38.44 36.83,38.44 v35.56,39.71
N$4  (via drill 0.35)
  Bottom 0.305: D3.C 83.3,48.6 R12.1
  other vias: 84.24,48.6
N$5  (via drill 0.35)
  Top 0.152: IC1.23 60.93,36.5 61.21,36.78 61.84,36.78 62.27,37.21 62.27,37.72 62.85,38.29 | 62.85,38.29 C12.1 62.41,38.88 v62.41,39.54 | 62.7,38.44 62.85,38.29 | v50.18,38.69 50.18,38.63 51.11,37.7 IC1.45 | IC1.50 v50.6,35.7 49.76,35.7 49.35,35.29 48.43,35.29 C11.1
  Top 0.305: v50.18,38.69 C13.1 | v62.41,39.54 62.41,38.74 62.7,38.44
  Bottom 0.152: 60.07,39.71 59.69,39.71
  Bottom 0.305: v50.6,35.7 50.18,36.12 v50.18,38.69 52.32,38.69 53.34,39.71 59.69,39.71 59.74,39.66 60.12,39.66 60.25,39.54 v62.41,39.54
N$8
  Bottom 0.152: R1.1 D2.A
N$16
  Top 0.152: S1.1 S1.2 38.1,43.8 38.1,21.43 40.53,19 R2.2
N$17
  Top 0.152: 71.54,42.54 71.12,42.12 XTAL1.1 71.12,37.17 69.85,35.9 68.58,35.9 68.44,35.9 C16.1 67.17,37.03 66.04,35.9 R3.1
N$18
  Top 0.152: XTAL1.2 71.22,30.67 71.22,30.92 | 71.22,30.92 71.49,30.66 71.49,29.31 | IC1.20 66.15,35.3 C15.1 68.47,35.3 68.58,35.3 69.94,35.3 71.22,34.02 71.22,30.92
N$19
  Top 0.152: IC1.21 61.53,35.7 R3.2
N$20
  Top 0.152: IC1.47 49.8,36.9 49.53,37.17 R4.1
N$21
  Top 0.152: IC1.46 50.67,37.3 49.53,38.44 R5.1
QSPI_SCLK
  Top 0.152: U4.16 46.75,33.05 48.39,33.05 49.96,34.63 50.82,34.63 51.09,34.9 IC1.52
QSPI_SD0
  Top 0.152: 52.07,34.5 IC1.53 51.12,34.5 50.95,34.33 50.09,34.33 48.51,32.75 48.24,32.75 U4.15
QSPI_SD1  (via drill 0.35)
  Top 0.152: IC1.55 52.37,33.63 51.94,33.63 49.53,31.22 49.53,29.33 45.63,25.43 v45.63,22.02 | v46.99,20.66 45.68,19.35 U4.8
  Bottom 0.152: v45.63,22.02 v46.99,20.66
QSPI_SD2  (via drill 0.35)
  Top 0.152: v50.8,33.36 51.54,34.1 IC1.54 | U4.9 52.11,26.96 52.19,27.04 52.19,30.68 v51.37,31.5
  Bottom 0.152: v51.37,31.5 51.37,32.79 v50.8,33.36
QSPI_SD3
  Top 0.152: IC1.51 51.06,35.3 50.85,35.09 49.99,35.09 48.26,33.36 45.72,33.36 41.91,29.55 41.91,28.22 U4.1
QSPI_SS
  Top 0.152: R2.1 42.47,18 U4.7 46.51,22.04 46.51,24.95 50.39,28.83 50.39,31.65 52.04,33.3 IC1.56
SI_CLK_C  (via drill 0.35)
  Top 0.152: IC1.36 55.68,48.78 48.26,56.2 34.27,56.2 v33.02,54.95
  Bottom 0.152: v33.02,54.95 33.02,16.85 34.53,15.34 J1.19
SI_DATA_C  (via drill 0.35)
  Top 0.152: IC1.35 56.08,48.81 48.39,56.5 33.3,56.5 v31.75,54.95 | v31.75,21.93 v29.21,21.93
  Bottom 0.152: v31.75,54.95 v31.75,21.93 | v29.21,21.93 29.53,21.61 J1.21
SWCLK
  Top 0.152: IC1.24 59.33,36.92 60.91,36.92 61.59,37.6 61.59,39.58 62.23,40.22 66.55,40.22 71.12,44.79 81.28,44.79 90.17,35.9 DEBUG.3
SWD
  Top 0.152: IC1.25 60.83,37.3 60.85,37.28 61.29,37.73 61.29,39.71 62.1,40.52 66.42,40.52 70.99,45.09 89.86,45.09 DEBUG.1
UART_RX  (via drill 0.35)
  Top 0.152: IC1.41 53.68,40.48 53.87,40.67 53.87,43.88 v52.96,44.79
  Bottom 0.152: v52.96,44.79 53.7,45.52 53.7,47.71 57.44,51.45 66.24,51.45 67.7,52.9 74.54,52.9 76,51.45 86.49,51.45 86.79,51.14 UART.1
UART_TX  (via drill 0.35)
  Top 0.152: IC1.40 54.08,40.45 54.17,40.55 54.17,44.49 v53.87,44.79
  Bottom 0.152: v53.87,44.79 54,44.92 54,47.58 57.56,51.14 66.37,51.14 67.83,52.6 74.42,52.6 75.87,51.14 86.36,51.14 88.9,48.6 UART.2

### Text on the board
Top: BACK
Bottom: N64cart v3 / pdaXrom.org, 2024 | FRONT
bPlace: RX | TX | GND | SWD | GND | SWCLK